# Altium schematic sheet Power.SchDoc
size A4
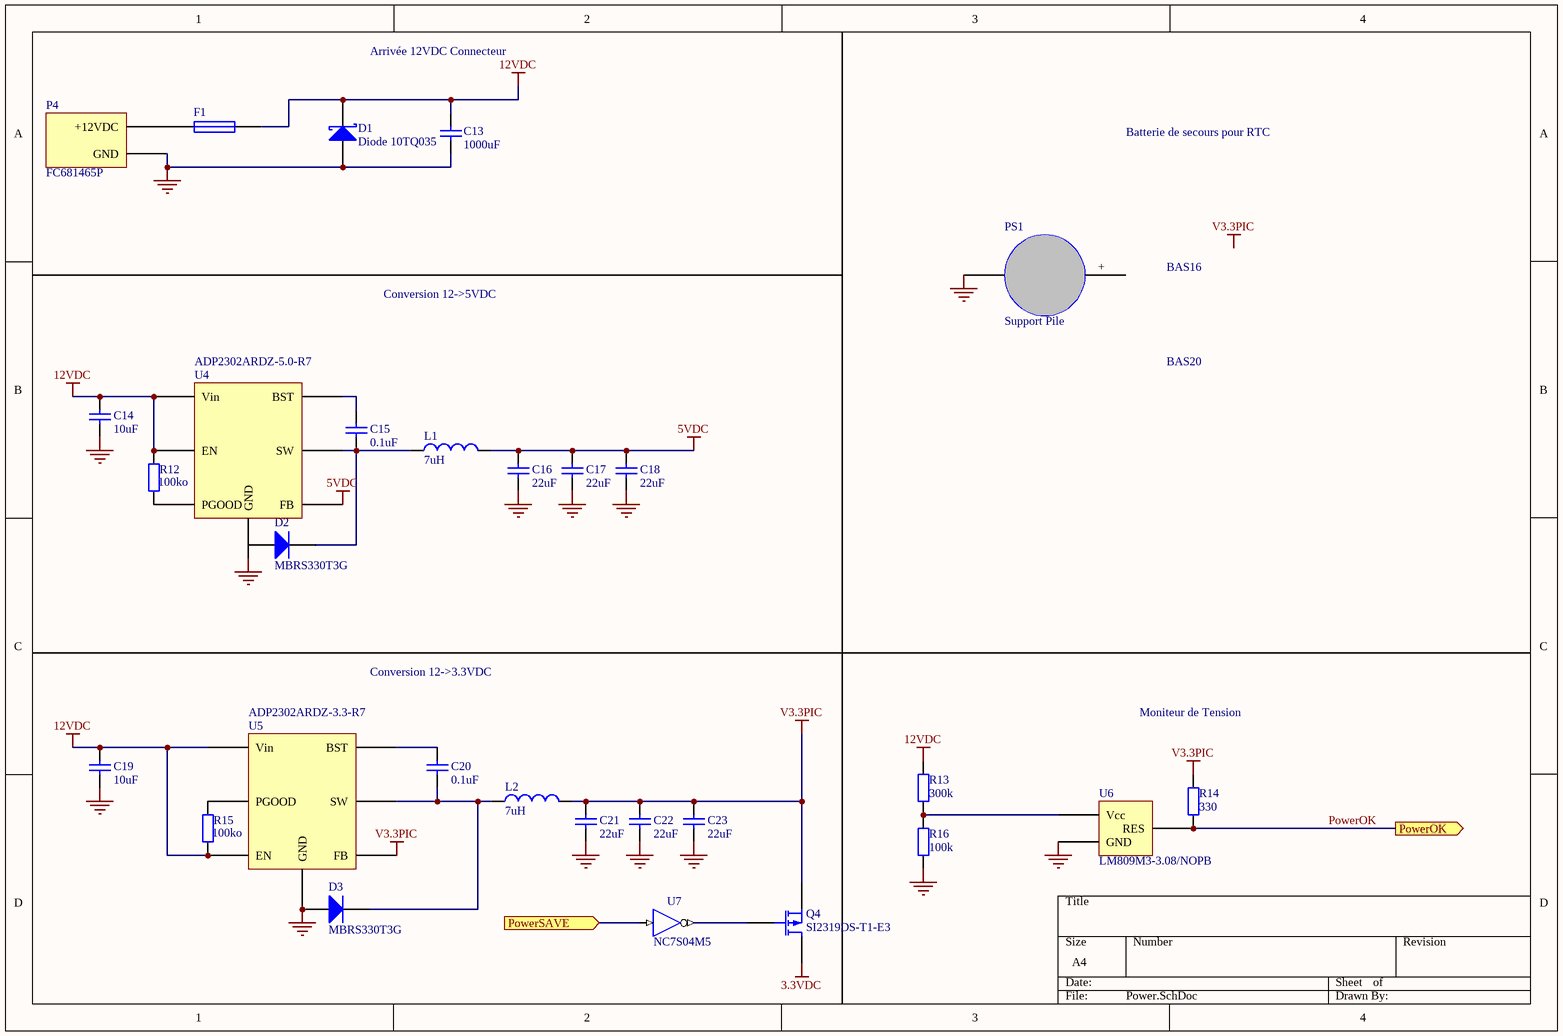
[diagram p0: Power.SchDoc]

## Parts
C13  1000uF  [RAD-0.3]
C14  10uF  [RAD-0.3]
C15  0.1uF  [RAD-0.3]
C16  22uF  [RAD-0.3]
C17  22uF  [RAD-0.3]
C18  22uF  [RAD-0.3]
C19  10uF  [RAD-0.3]
C20  0.1uF  [RAD-0.3]
C21  22uF  [RAD-0.3]
C22  22uF  [RAD-0.3]
C23  22uF  [RAD-0.3]
D1  Diode 10TQ035  [TO-220AC]
D2  MBRS330T3G  [SMC]
D3  MBRS330T3G  [SMC]
F1  Fuse 1  [PIN-W2/E2.8]  (value not drawn)
L1  7uH  [0402-A]
L2  7uH  [0402-A]
P4  FC681465P
PS1  Support Pile
Q4  SI2319DS-T1-E3  [E3]
R12  100ko  [AXIAL-0.4]
R13  300k  [AXIAL-0.4]
R14  330  [AXIAL-0.4]
R15  100ko  [AXIAL-0.4]
R16  100k  [AXIAL-0.4]
U4  ADP2302ARDZ-5.0-R7
U5  ADP2302ARDZ-3.3-R7
U6  LM809M3-3.08/NOPB
U7  NC7S04M5

## Ports
PowerOK (out), PowerSAVE (in)

## Nets
3.3VDC: Q4.1(D)
5VDC: C16.1 C17.1 C18.1 L1.2 U4.FB
12VDC: C13.2 C14.1 C19.1 D1.1(K) F1.2 R12.2 R13.2 R15.1 U4.EN U4.Vin U5.EN U5.Vin
GND: C13.1 C14.2 C16.2 C17.2 C18.2 C19.2 C21.2 C22.2 C23.2 D1.3(A) D3.1(A) P4.GND PS1.- R16.1 U4.GND U5.GND U6.GND
V3.3PIC: C21.1 C22.1 C23.1 L2.2 Q4.3(S) R14.2 U5.FB
PowerOK: R14.1 U6.RES ; port PowerOK
PowerSAVE: U7.I ; port PowerSAVE
NetC15_1: C15.1 U4.BST
NetC15_2: C15.2 D2.2(K) L1.1 U4.SW
NetC20_1: C20.1 U5.BST
NetC20_2: C20.2 D3.2(K) L2.1 U5.SW
NetF1_1: F1.1 P4.+12VDC
NetQ4_2: Q4.2(G) U7.O
NetR12_1: R12.1 U4.PGOOD
NetR13_1: R13.1 R16.2 U6.Vcc
NetR15_2: R15.2 U5.PGOOD

Not connected (* = marked no-connect by the designer): D2 1(A); PS1 +

## Notes on the sheet
- Arrivée 12VDC Connecteur
- Batterie de secours pour RTC
- Conversion 12->5VDC
- BAS16
- BAS20
- Conversion 12->3.3VDC
- Moniteur de Tension
- Labels drawn without touching a wire or pin: PowerOK, V3.3PIC

## Library data of the parts
C13 = Cap: Capacitor; Ref.Fournisseur: 1902972; Fournisseur: Farnell; Fabricant: Multicomp; Ref.Fabricant: MCGLR16V108M10X16
C14 = Cap: Cin_Reg_5v; Fournisseur: Farnell; Fabricant: KEMET; Ref.Fabricant: C1210C106K3RACTU; Ref.Fournisseur: 1358512; Value: 10uF
C15 = Cap: Cbst_Reg_5v; Value: 0.1000000001uF; Fournisseur: Farnell; Fabricant: TDK; Ref.Fabricant: CGA2B3X7R1E104K050BB; Ref.Fournisseur: 2210820
C16-C18 C21-C23 = Cap: Cout_Reg_3.3v; Fournisseur: Farnell; Fabricant: AVX; Ref.Fabricant: 12103D226KAT2A; Ref.Fournisseur: 1833829; Value: 22uF
C19 = Cap: Cin_Reg_3v; Fournisseur: Farnell; Fabricant: KEMET; Ref.Fabricant: C1210C106K3RACTU; Ref.Fournisseur: 1358512; Value: 10uF
C20 = Cap: Cbst_Reg_3.3v; Value: 0.10uF; Fournisseur: Farnell; Fabricant: TDK; Ref.Fabricant: CGA2B3X7R1E104K050BB; Ref.Fournisseur: 2210820
D1 = Diode 10TQ035: Diode Zenner; Fournisseur: Farnell; Ref.Fournisseur: 2453991; Fabricant: ON SEMICONDUCTOR; Ref.Fabricant: MM3Z15VB
D2 D3 = Diode: Schottky; Fournisseur: Farnell; Ref.Fournisseur: 1459078; Fabricant: OnSemiconductor; Ref.Fabricant: MBRS330T3G
F1 = Fuse 1: Fuse; Fournisseur: Farnell; Ref.Fournisseur: 1596504; Fabricant: Littelfuse; Ref.Fabricant: 39515000000
L1 = Inductor: L_Reg_5v; Fabricant: Coilcraft; Ref.Fabricant: MSS1038-702NLC; Fournisseur: Farnell; Ref.Fournisseur: 2288224; Value: 7uH
L2 = Inductor: L_Reg_3.3v; Fabricant: Coilcraft; Ref.Fabricant: MSS1038-702NLC; Fournisseur: Farnell; Ref.Fournisseur: 2288224; Value: 7uH
P4 = FC68148S: Power connector; Fournisseur: Farnell; Ref.Fournisseur: 1854512; Fabricant: CLIFF; Ref.Fabricant: FC681465P
PS1 = SMTU-1225-1-LF: Fournisseur: Farnell; Fabricant: Renata; Ref.Fournisseur: 1216353; Ref.Fabricant: SMTU-1225-1-LF
Q4 = MOSFET-P: P-Channel MOSFET; Fabricant: VISHAY; Ref.Fournisseur: 1838990; Fournisseur: Farnell; Ref.Fabricant: SI2319DS-T1-E3
R12 R15 = Res2: Resistor; Fournisseur: Farnell; Ref.Founisseur: 2447226; Fabricant: Multicomp; Ref.Fabricant: MCWR06X1003FTL
R13 = Res2: Resistor; Fournisseur: Farnell; Ref.Fournisseur: 2074433; Fabricant: MULTICOMP; Ref.Fabricant: MCSR08X3003FTL; Value: 300k
R14 = Res2: Resistor; Fabricant: TE Connectivity; Fournisseur: Farnell; Ref.Fabricant: RN73C1J232RBTDF; Ref.Fournisseur: 2687973
R16 = Res2: Resistor; Fournisseur: Farnell; Ref.Fournisseur: 2447226; Fabricant: MULTICOMP; Ref.Fabricant: MCWR06X1003FTL; Value: 100k
U4 = ADP2302ARDZ-5.0-R7: Convert. 5v; Fournisseur: Farnell; Ref.Fournisseur: 2727507; Fabricant: Analog Devices; Ref.Fabricant: ADP2302ARDZ-5.0-R7
U5 = ADP2302ARDZ-3.3-R7: Convert.3.3; Fournisseur: Farnell; Ref.Fournisseur: 2376914; Fabricant: Analog Devices; Ref.Fabricant: ADP2302ARDZ-3.3-R7
U6 = LM809M3-3.08/NOPB: Voltage Monitor; Fournisseur: Farnell; Ref.Fournisseur: 2352609; Fabricant: TEXAS INSTRUMENTS; Ref.Fabricant: LM809M3-3.08/NOPB
U7 = INV: Inverter; Fabricant: ON SEMICONDUCTOR; Ref.Fournisseur: 1014133; Fournisseur: Farnell; Ref.Fabricant: NC7S04M5